# EAGLE schematic CheetahBoosterMCU (EAGLE 7.6.0)
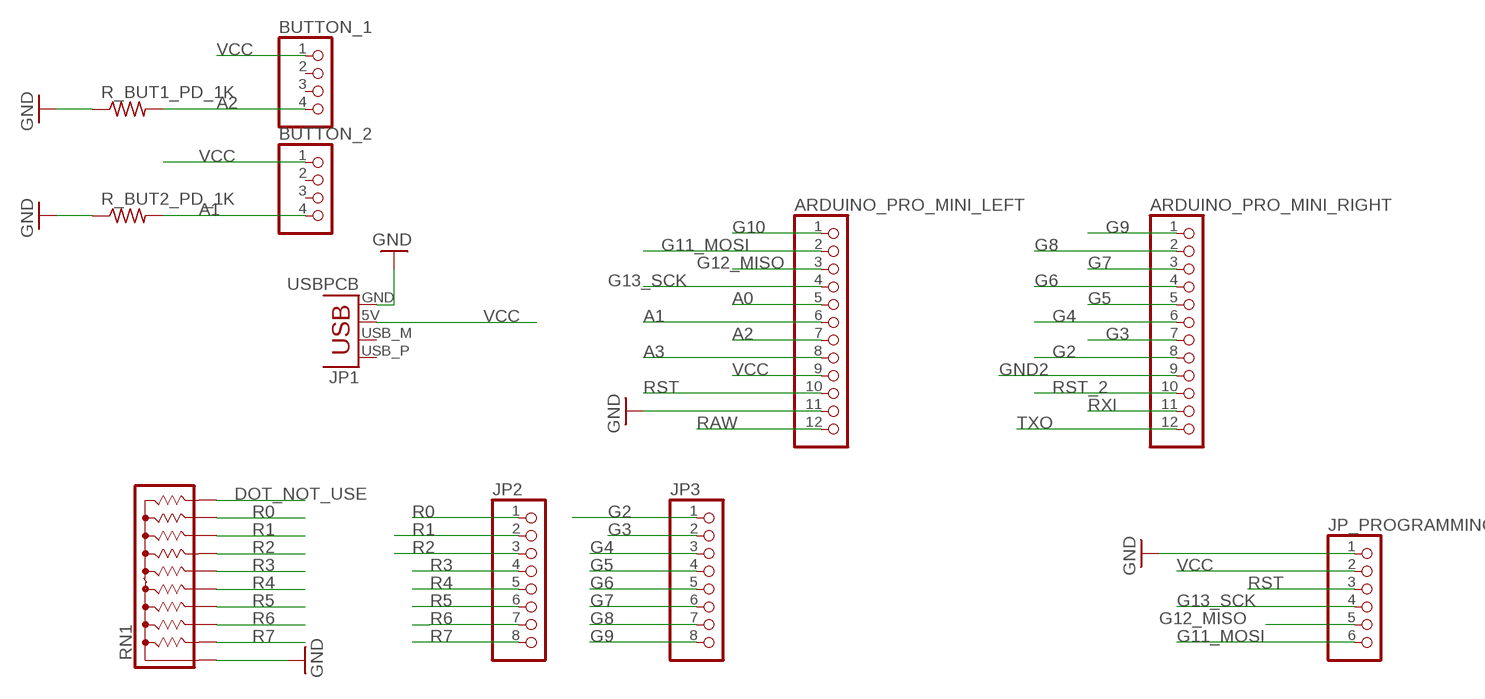
[diagram p0: schematic, sheet 1]

## Parts
ARDUINO_PRO_MINI_LEFT  PINHD-1X12  [1X12]
ARDUINO_PRO_MINI_RIGHT  PINHD-1X12  [1X12]
BUTTON_1  PINHD-1X4  [1X04]
BUTTON_2  PINHD-1X4  [1X04]
JP1  USBPCB  [USB-A-PCB]
JP2  PINHD-1X8  [1X08]
JP3  PINHD-1X8  [1X08]
JP_PROGRAMMING  PINHD-1X6  [1X06]
R_BUT1_PD_1K  R-US_R1206  [R1206]
R_BUT2_PD_1K  R-US_R1206  [R1206]
RN1  4610X  [SIP10]

## Nets
A0: ARDUINO_PRO_MINI_LEFT.5
A1: ARDUINO_PRO_MINI_LEFT.6 BUTTON_2.4 R_BUT2_PD_1K.2
A2: ARDUINO_PRO_MINI_LEFT.7 BUTTON_1.4 R_BUT1_PD_1K.2
A3: ARDUINO_PRO_MINI_LEFT.8
DOT_NOT_USE: RN1.10
G2: ARDUINO_PRO_MINI_RIGHT.8 JP3.1
G3: ARDUINO_PRO_MINI_RIGHT.7 JP3.2
G4: ARDUINO_PRO_MINI_RIGHT.6 JP3.3
G5: ARDUINO_PRO_MINI_RIGHT.5 JP3.4
G6: ARDUINO_PRO_MINI_RIGHT.4 JP3.5
G7: ARDUINO_PRO_MINI_RIGHT.3 JP3.6
G8: ARDUINO_PRO_MINI_RIGHT.2 JP3.7
G9: ARDUINO_PRO_MINI_RIGHT.1 JP3.8
G10: ARDUINO_PRO_MINI_LEFT.1
G11_MOSI: ARDUINO_PRO_MINI_LEFT.2 JP_PROGRAMMING.6
G12_MISO: ARDUINO_PRO_MINI_LEFT.3 JP_PROGRAMMING.5
G13_SCK: ARDUINO_PRO_MINI_LEFT.4 JP_PROGRAMMING.4
GND: ARDUINO_PRO_MINI_LEFT.11 JP1.GND JP_PROGRAMMING.1 R_BUT1_PD_1K.1 R_BUT2_PD_1K.1 RN1.1
GND2: ARDUINO_PRO_MINI_RIGHT.9
R0: JP2.1 RN1.9
R1: JP2.2 RN1.8
R2: JP2.3 RN1.7
R3: JP2.4 RN1.6
R4: JP2.5 RN1.5
R5: JP2.6 RN1.4
R6: JP2.7 RN1.3
R7: JP2.8 RN1.2
RAW: ARDUINO_PRO_MINI_LEFT.12
RST: ARDUINO_PRO_MINI_LEFT.10 JP_PROGRAMMING.3
RST_2: ARDUINO_PRO_MINI_RIGHT.10
RXI: ARDUINO_PRO_MINI_RIGHT.11
TXO: ARDUINO_PRO_MINI_RIGHT.12
VCC: ARDUINO_PRO_MINI_LEFT.9 BUTTON_1.1 BUTTON_2.1 JP1.5V(VBUS) JP_PROGRAMMING.2
Unconnected: BUTTON_1.2 BUTTON_1.3 BUTTON_2.2 BUTTON_2.3 JP1.USB_M(D-) JP1.USB_P(D+)

## Library data of the parts
ARDUINO_PRO_MINI_LEFT ARDUINO_PRO_MINI_RIGHT = adafruit:PINHD-1X12: PIN HEADER
BUTTON_1 BUTTON_2 = pinhead:PINHD-1X4: PIN HEADER
JP1 = SparkFun-Connectors:USB: USB Connectors USB-B-PTH is fully proven SKU : PRT-00139/CONN-08278 USB-miniB is fully proven SKU : PRT-00587 USB-A-PCB is untested. USB-A-H is throughly reviewed, but untested. Spark Fun Electronics SKU : PRT-00437 USB-B-SMT is throughly reviewed, but untested. Needs silkscreen touching up. USB-A-S has not been used/tested USB-MB-H has not been used/tested USB-MICROB has been used. CONN-09505
JP2 JP3 = pinhead:PINHD-1X8: PIN HEADER
JP_PROGRAMMING = adafruit:PINHD-1X6: PIN HEADER
R_BUT1_PD_1K R_BUT2_PD_1K = adafruit:R-US_: RESISTOR, American symbol
RN1 = resistor-sip:4610X: Bourns 4600X Series - Thick Film Conformal SIPs 4610X-101 Resistor Network Configuration: 101 (Bussed Resistors) Resistance range: 10 ohms to 10 Megaohms Maximum Operating Voltage: 100V Source: http://www.bourns.com/ProductLine.aspx?name=standard_thick_film_networks PDF: http://www.bourns.com/data/global/pdfs/4600X.pdf